# EAGLE design MAVBoard_Pro (EAGLE 6.4)
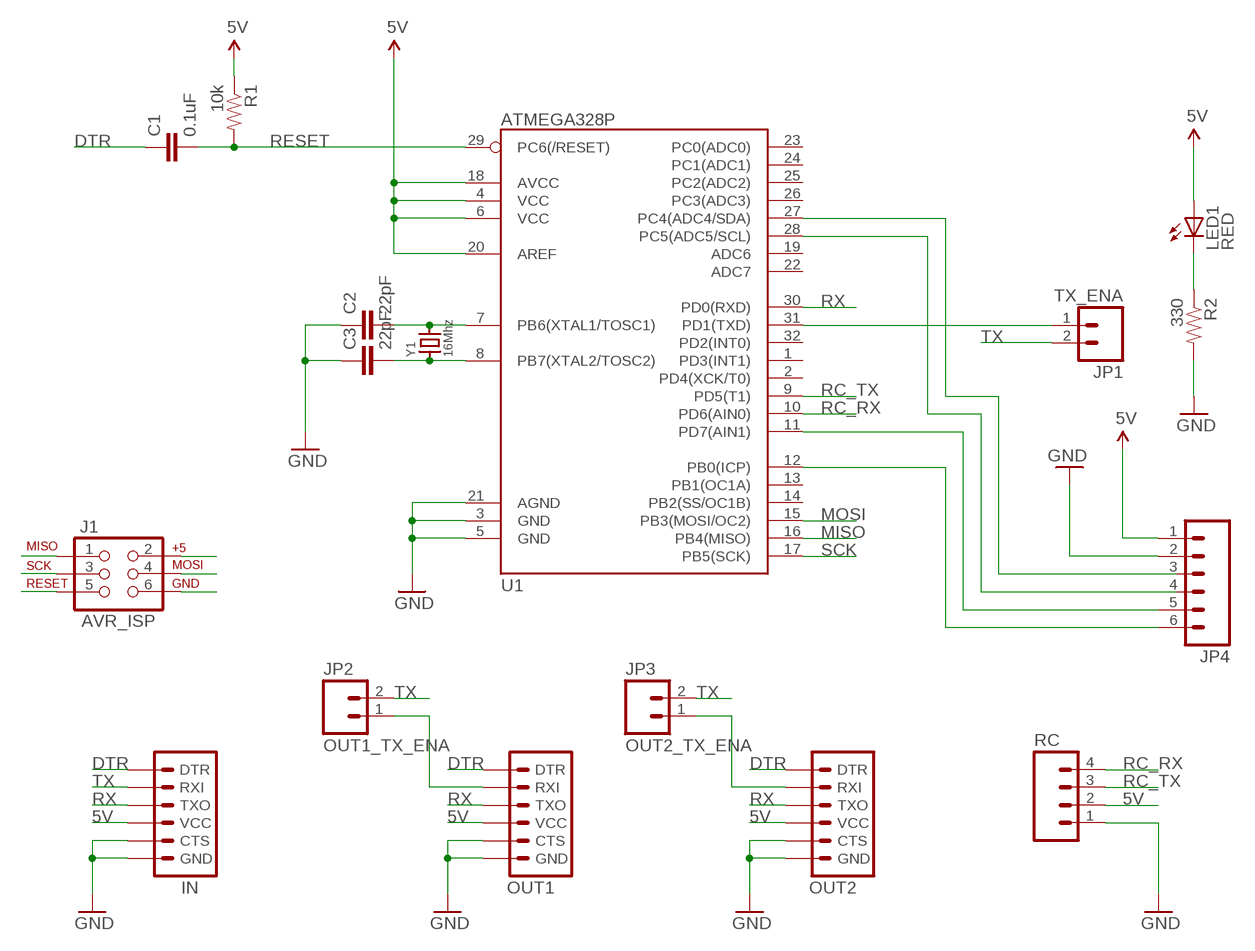
[diagram p0: schematic, sheet 1]

## Parts
C1  0.1uF  CAP0603-CAP  [0603-CAP]
C2  22pF  CAP0603-CAP  [0603-CAP]
C3  22pF  CAP0603-CAP  [0603-CAP]
IN  ARDUINO_SERIAL_PROGRAMPTH  [1X06]
J1  AVR_ISP  AVR_SPI_PRG_6PTH  [2X3]
JP1  TX_ENA  M02PTH  [1X02]
JP2  OUT1_TX_ENA  M02PTH  [1X02]
JP3  OUT2_TX_ENA  M02PTH  [1X02]
JP4  M06SIP  [1X06]
LED1  RED  LED0603  [LED-0603]
OUT1  ARDUINO_SERIAL_PROGRAMPTH  [1X06]
OUT2  ARDUINO_SERIAL_PROGRAMPTH  [1X06]
R1  10k  RESISTOR0603-RES  [0603-RES]
R2  330  RESISTOR0603-RES  [0603-RES]
RC  M04PTH  [1X04]
U1  ATMEGA328P  ATMEGA328_SMT  [TQFP32-08]
Y1  16Mhz  CRYSTAL5X3.2  [CRYSTALSMD_5X3.2MM]

## Nets
5V: IN.4(VCC) J1.2 JP4.1 LED1.A OUT1.4(VCC) OUT2.4(VCC) R1.1 RC.2 U1.4(VCC) U1.6(VCC) U1.18(AVCC) U1.20(AREF)
A4: JP4.3 U1.27(PC4(ADC4/SDA))
A5: JP4.4 U1.28(PC5(ADC5/SCL))
D7: JP4.5 U1.11(PD7(AIN1))
D8: JP4.6 U1.12(PB0(ICP))
DTR: C1.1 IN.1(DTR) OUT1.1(DTR) OUT2.1(DTR)
GND: C2.1 C3.1 IN.5(CTS) IN.6(GND) J1.6 JP4.2 OUT1.5(CTS) OUT1.6(GND) OUT2.5(CTS) OUT2.6(GND) R2.2 RC.1 U1.3(GND) U1.5(GND) U1.21(AGND)
MISO: J1.1 U1.16(PB4(MISO))
MOSI: J1.4 U1.15(PB3(MOSI/OC2))
N$1: C2.2 U1.7(PB6(XTAL1/TOSC1)) Y1.PIN3
N$2: JP2.1 OUT1.2(RXI)
N$3: LED1.C R2.1
N$4: C3.2 U1.8(PB7(XTAL2/TOSC2)) Y1.PIN1
N$5: JP3.1 OUT2.2(RXI)
N$6: JP1.1 U1.31(PD1(TXD))
RC_RX: RC.4 U1.10(PD6(AIN0))
RC_TX: RC.3 U1.9(PD5(T1))
RESET: C1.2 J1.5 R1.2 U1.29(PC6(/RESET))
RX: IN.3(TXO) OUT1.3(TXO) OUT2.3(TXO) U1.30(PD0(RXD))
SCK: J1.3 U1.17(PB5(SCK))
TX: IN.2(RXI) JP1.2 JP2.2 JP3.2
Unconnected: U1.1(PD3(INT1)) U1.2(PD4(XCK/T0)) U1.13(PB1(OC1A)) U1.14(PB2(SS/OC1B)) U1.19(ADC6) U1.22(ADC7) U1.23(PC0(ADC0)) U1.24(PC1(ADC1)) U1.25(PC2(ADC2)) U1.26(PC3(ADC3)) U1.32(PD2(INT0))

## Library data of the parts
C1-C3 = SparkFun-Passives:CAP: Capacitor Standard 0603 ceramic capacitor, and 0.1" leaded capacitor.
IN OUT1 OUT2 = SparkFun-Connectors:ARDUINO_SERIAL_PROGRAM: FTDI connector footprints
J1 = SparkFun-Connectors:AVR_SPI_PRG_6: AVR ISP 6 Pin This is the reduced ISP connector for AVR programming. Common on Arduino. This footprint will take up less PCB space and can be used with a 10-pin to 6-pin adapter such as SKU: BOB-08508
JP1-JP3 = SparkFun-Connectors:M02: Header 2 Standard 2-pin 0.1" header. Use with straight break away headers (SKU : PRT-00116), right angle break away headers (PRT-00553), swiss pins (PRT-00743), machine pins (PRT-00117), and female headers (PRT-00115). Molex polarized connector foot print use with SKU : PRT-08233 with associated crimp pins and housings.
JP4 = SparkFun-Connectors:M06: Header 6 Standard 6-pin 0.1" header. Use with straight break away headers (SKU : PRT-00116), right angle break away headers (PRT-00553), swiss pins (PRT-00743), machine pins (PRT-00117), and female headers (PRT-00115). Molex polarized connector foot print use with SKU : PRT-08094 with associated crimp pins and housings. NOTES ON THE VARIANTS LOCK and LOCK_LONGPADS... This footprint was designed to help hold the alignment of a through-hole component (i.e. 6-pin header) while soldering it into place. You may notice that each hole has been shifted either up or down by 0.005 of an inch from it's more standard position (which is a perfectly straight line). This slight alteration caused the pins (the squares in the middle) to touch the edges of the holes. Because they are alternating, it causes a "brace" to hold the component in place. 0.005 has proven to be the perfect amount of "off-center" position when using our standard breakaway headers. Although looks a little odd when you look at the bare footprint, once you have a header in there, the alteration is very hard to notice. Also, if you push a header all the way into place, it is covered up entirely on the bottom side. This idea of altering the position of holes to aid alignment will be further integrated into the Sparkfun Library for other footprints. It can help hold any component with 3 or more connection pins.
LED1 = SparkFun-LED:LED: LEDs Standard schematic elements and footprints for 5mm, 3mm, 1206, and 0603 sized LEDs. 5mm - Spark Fun Electronics SKU : COM-00529 (and others)
R1 R2 = SparkFun-Passives:RESISTOR: Resistor Basic schematic elements and footprints for 0603, 1206, and PTH resistors.
RC = SparkFun-Connectors:M04: Header 4 Standard 4-pin 0.1" header. Use with straight break away headers (SKU : PRT-00116), right angle break away headers (PRT-00553), swiss pins (PRT-00743), machine pins (PRT-00117), and female headers (PRT-00115). Molex polarized connector foot print use with SKU : PRT-08231 with associated crimp pins and housings. 1MM SMD Version SKU: PRT-10208
U1 = SparkFun-DigitalIC:ATMEGA328_SMT: 32-Pin Atmega328 part Commonly used on Arduino compatible boards Available in QFP and QFN packages TQFP is IC-09069 QFN is non-stock; PROD_ID: IC-09069
Y1 = machadolab:CRYSTAL

## Board
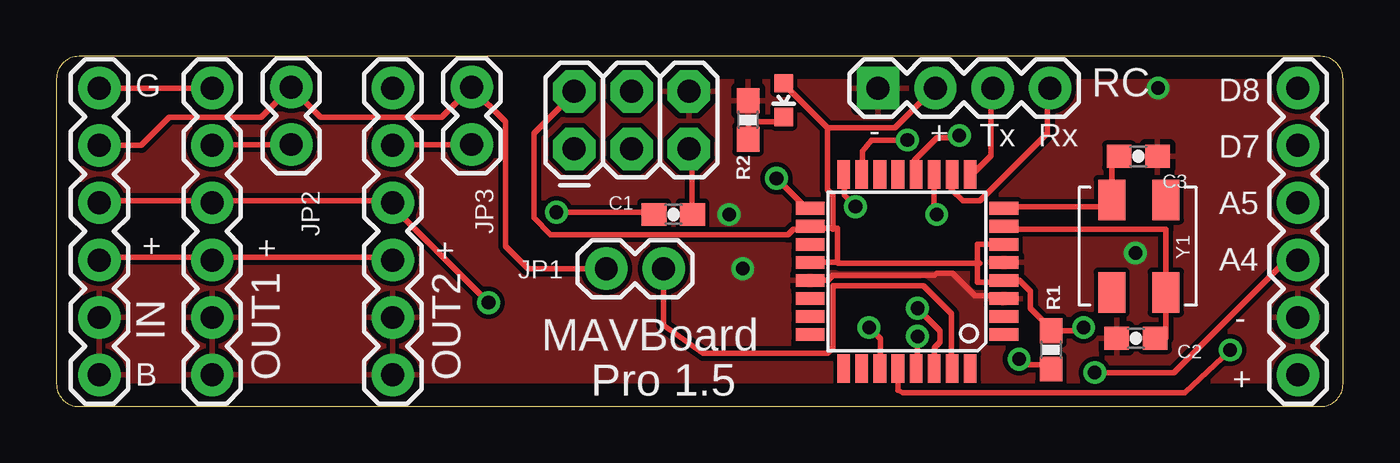
[diagram p1: board, top side]
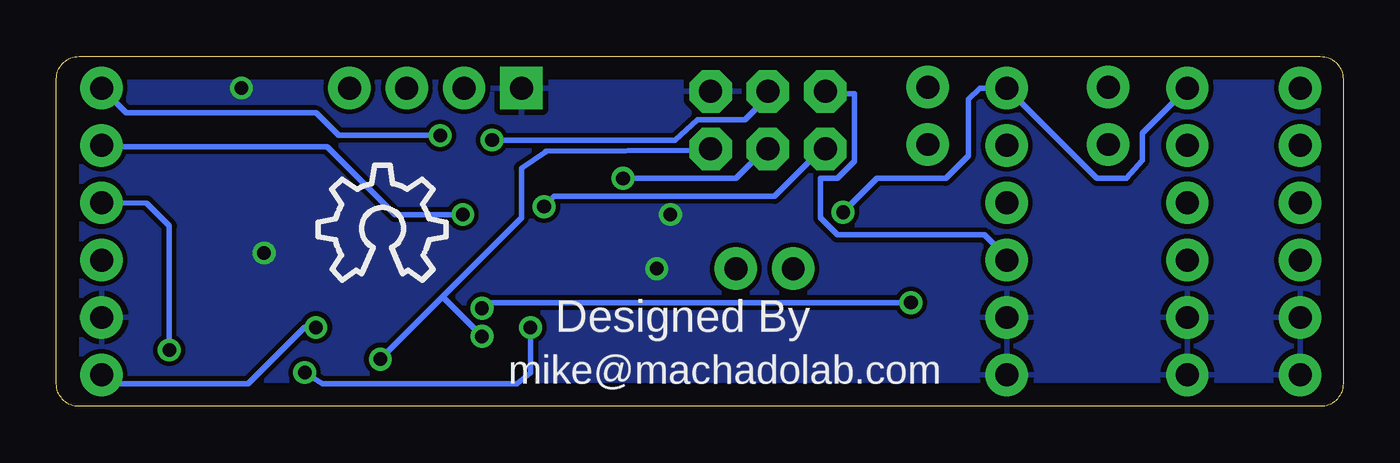
[diagram p2: board, bottom side, seen from below]

Size 57 x 15.5 mm. Coordinates in mm from the lower left corner, seen from the top.
Outline: 1,0 56,0 arc90 57,1 57,14.5 arc90 56,15.5 1,15.5 arc90 0,14.5 0,1 arc90 1,0
Copper layers (1*16): Top 0.035mm / dielectric 1.5mm / Bottom 0.035mm
Design rules "default": minimum track width 10mil, minimum drill 24mil, track to track 8mil, track to pad 8mil, pad to pad 8mil, via to via 8mil, smd to smd 8mil, copper to edge 40mil, drill to drill 8mil, minimum pad ring 10mil, minimum via ring 8mil, stop-mask expansion 4mil, vias tented up to drill 0mil, thermal gap 10mil

### Footprints (pad centres in the part's own frame; a part is rotated, then mirrored left to right if it is on the bottom)
0603-CAP = smd 1.1 x 1: 1 -0.85,0; 2 0.85,0
1X06 = drill 1.016 pad 1.88: 1 0,0; 2 2.54,0; 3 5.08,0; 4 7.62,0; 5 10.16,0; 6 12.7,0
2X3 = drill 1.016 pad 1.88 octagon: 1 0,0; 2 0,2.54; 3 2.54,0; 4 2.54,2.54; 5 5.08,0; 6 5.08,2.54
1X02 = drill 1.016 pad 1.88: 1 0,0; 2 2.54,0
LED-0603 = smd 0.8 x 0.8: A 0,-0.75; C 0,0.75
0603-RES = smd 1.1 x 1: 1 -0.85,0; 2 0.85,0
1X04 = drill 1.016 pad 1.88 square: 1 0,0 | drill 1.016 pad 1.88: 2 2.54,0; 3 5.08,0; 4 7.62,0
TQFP32-08 = smd 1.27 x 0.559: 1 -4.293,2.8; 2 -4.293,2; 3 -4.293,1.2; 4 -4.293,0.4; 5 -4.293,-0.4; 6 -4.293,-1.2; 7 -4.293,-2; 8 -4.293,-2.8; 17 4.293,-2.8; 18 4.293,-2; 19 4.293,-1.2; 20 4.293,-0.4; 21 4.293,0.4; 22 4.293,1.2; 23 4.293,2; 24 4.293,2.8 | smd 0.559 x 1.27: 9 -2.8,-4.293; 10 -2,-4.293; 11 -1.2,-4.293; 12 -0.4,-4.293; 13 0.4,-4.293; 14 1.2,-4.293; 15 2,-4.293; 16 2.8,-4.293; 25 2.8,4.293; 26 2,4.293; 27 1.2,4.293; 28 0.4,4.293; 29 -0.4,4.293; 30 -1.2,4.293; 31 -2,4.293; 32 -2.8,4.293
CRYSTALSMD_5X3.2MM = smd 1.8 x 1.2: PIN1 -2.05,-1.15; PIN2 2.05,-1.15; PIN3 2.05,1.25; PIN4 -2.05,1.25

### Placement (x,y rotation side)
C1  27.33,8.5 0 top
C2  47.82,3.02 0 top
C3  47.93,11.08 180 top
IN  1.9,14.1 270 top
J1  22.94,11.41 0 top
JP1  26.9,6.1 180 top
JP2  10.4,11.6 90 top
JP3  18.4,11.6 90 top
JP4  55,1.4 90 top
LED1  32.22,13.57 180 top
OUT1  6.9,14.1 270 top
OUT2  14.9,14.1 270 top
R1  44.06,2.51 270 top
R2  30.64,12.69 90 top
RC  36.4,14.1 0 top
U1  37.68,5.98 180 top
U$3  [OSHW_10X200_NOTEXT]  45.4,5.6 0 bottom
Y1  47.9,7.1 270 top

### Tracks (layer width: path | path; a pad name or v marks a point on that pad's centre or on a via)
5V  (via drill 0.6)
  Top 0.254: U1.6 40.8,7.18 40.8,6.35 | 40.8,6.35 40.8,5.5 41.97,5.5 U1.4 42.15,5.6 42.65,5.6 43.15,5.1 43.15,4.35 43.9,3.6 R1.1 45.36,3.36 v45.5,3.5 | U1.20 34.6,6.38 | 34.6,6.38 34.6,7.9 34.4,7.9 | 34.4,7.9 33.39,7.9 U1.18 33.15,7.85 32.65,7.85 32.4,7.6 21.9,7.6 21.15,8.35 21.15,12.1 22.9,13.85 J1.2 | 6.9,6.6 1.9,6.6 IN.4 | 6.9,6.6 14.9,6.6 OUT2.4 | 6.9,6.6 OUT1.4 | 34.15,12.35 32.4,14.1 LED1.A | 34.15,12.35 34.15,9.6 34.4,9.35 34.4,7.9 | 34.4,7.85 34.4,7.9 | 40.8,6.35 34.65,6.35 34.6,6.38 | 40.9,6.35 40.8,6.35 | 34.15,12.35 37.15,12.35 38.9,14.1 RC.2
  Bottom 0.254: OUT2.4 14.9,6.6 15.9,7.6 22.4,7.6 23.15,8.35 23.15,10.1 22.4,10.1 21.65,10.85 21.65,13.85 22.9,13.85 J1.2 | v45.5,3.5 46,3.5 48.5,1 54.6,1 JP4.1
A4  (via drill 0.6)
  Top 0.254: U1.27 36.5,2.5 36.5,3 v36,3.5 | v46,1.5 49.5,1.5 54.5,6.5 55.02,6.5 JP4.3
  Bottom 0.254: v36,3.5 36,1.5 36.6,1 45.2,1 v46,1.5
A5  (via drill 0.6)
  Top 0.254: U1.28 37.28,0.72 37.5,0.6 50,0.6 v52,2.5
  Bottom 0.254: v52,2.5 52,8 53,9 JP4.4
D7  (via drill 0.6)
  Top 0.254: U1.11 38.88,8.5 v39,8.5
  Bottom 0.254: v39,8.5 42,8.5 45,11.5 54.94,11.5 JP4.5
D8  (via drill 0.6)
  Top 0.254: U1.12 38,10.27 38,10.9 39,11.9 39.9,11.9 v40,12
  Bottom 0.254: v40,12 44.5,12 45.5,13 53.9,13 JP4.6
DTR  (via drill 0.61)
  Top 0.254: OUT1.1 IN.1 | v22.15,8.6 26.4,8.6 C1.1
  Bottom 0.254: v22.15,8.6 20.65,10.1 17.6,10.1 16.6,11.1 16.6,13.6 16.1,14.1 OUT2.1 10.9,10.1 9.6,10.1 8.9,10.9 8.9,12.1 OUT1.1
GND  (via drill 0.6)
  Top 0.254: U1.3 41.9,4.71 41.9,4.6 41.6,4.9 40.7,4.9 39.7,5.9 39,5.9 38.9,5.8 34.4,5.8 34.18,5.58 U1.21
  other vias: 48.8,14.1 47.8,6.8 29.8,8.5 30.4,6.1
  pour Bottom: 0,15.5 0,0 57,0 57,15.5
  pour Top: 57,15.5 0,15.5 0,0 57,0
MISO  (via drill 0.61)
  Top 0.254: v35.4,8.85 34.9,9.35 34.9,10.1 U1.16
  Bottom 0.254: v35.4,8.85 34.95,9.3 25.2,9.3 23.15,11.35 J1.1
MOSI  (via drill 0.6)
  Top 0.254: U1.15 35.7,10.27 35.7,11.3 36.1,11.8 v37.7,11.8
  Bottom 0.254: v37.7,11.8 29.6,11.8 28.6,12.7 26.5,12.7 25.48,13.72 J1.4
N$1
  Top 0.254: U1.7 42.15,7.85 49.15,7.85 Y1.PIN3 49.15,3.04 C2.2
N$2
  Top 0.254: JP2.1 6.9,11.6 OUT1.2
N$3
  Top 0.254: LED1.C 32.15,12.6 30.65,12.6 R2.1
N$4
  Top 0.254: U1.8 42.15,8.85 46.65,8.85 Y1.PIN1 46.75,10.75 C3.2
N$5
  Top 0.254: JP3.1 14.9,11.6 OUT2.2
N$6
  Top 0.254: JP1.1 26.9,3.6 28.65,2.35 34.15,2.35 34.4,2.6 34.4,5.35 38.4,5.35 39.65,4.1 39.65,1.85 U1.31
RC_RX
  Top 0.254: U1.10 39.65,10.1 39.65,9.6 40.15,9.1 40.9,9.1 43.9,12.1 43.9,14.1 RC.4
RC_TX
  Top 0.254: U1.9 40.65,10.35 41.4,11.1 41.4,14.1 RC.3
RESET  (via drill 0.61)
  Top 0.254: C1.2 28.15,8.6 28.15,11.35 J1.5 | v42.65,2.1 42.65,1.85 43.9,1.85 R1.2 | v38.15,3.1 38.15,1.85 U1.29
  Bottom 0.254: 39.9,4.85 36.4,8.35 36.4,10.55 35.35,11.25 35.3,11.3 28.15,11.35 J1.5 | 39.9,4.85 v42.65,2.1 | 39.9,4.85 v38.15,3.1
RX  (via drill 0.61)
  Top 0.254: 6.9,9.1 1.9,9.1 IN.3 | v38.15,4.35 39.15,3.35 39.15,2.85 38.9,2.6 38.9,1.85 U1.30 | v19.15,4.6 14.9,8.85 OUT2.3 14.9,9.1 6.9,9.1 | 6.9,9.1 OUT1.3
  Bottom 0.254: v38.15,4.35 37.9,4.6 v19.15,4.6
SCK  (via drill 0.61)
  Top 0.254: v31.9,10.1 33.15,8.85 U1.17
  Bottom 0.254: v31.9,10.1 26.9,10.1 25.65,11.35 J1.3
TX
  Top 0.254: JP1.2 20.9,6.1 19.9,7.1 19.9,12.6 18.4,14.1 JP3.2 17.06,12.8 11.7,12.8 10.4,14.1 JP2.2 9.06,12.8 5,12.8 3.76,11.56 IN.2

### Text on the board
tPlace: G | D8 | - | + | Tx | Rx | D7 | A5 | + | + | + | A4 | MAVBoard | - | Pro 1.5 | B | +
bPlace: Designed By | mike@machadolab.com